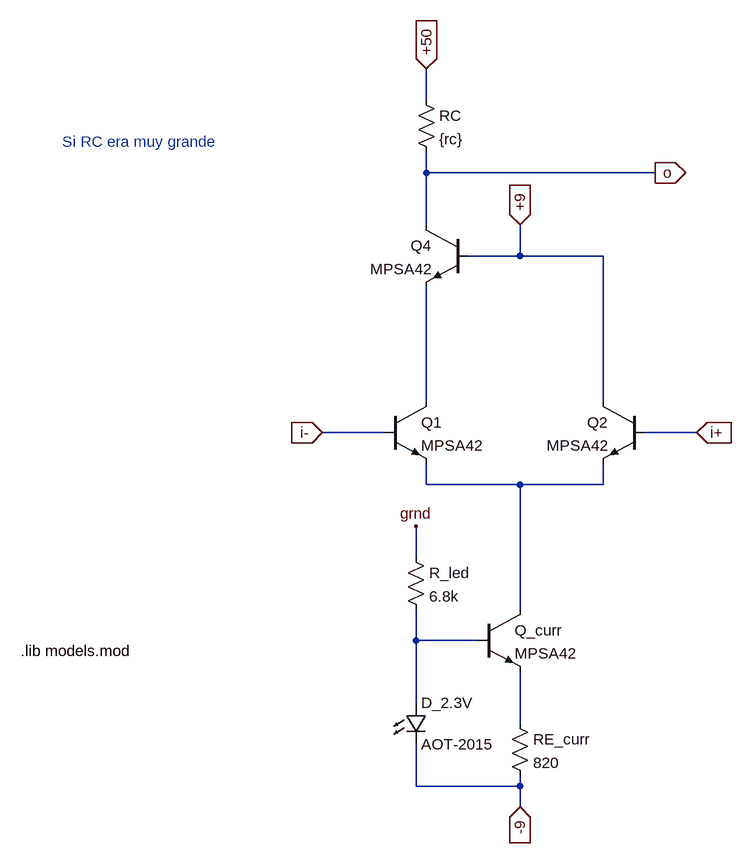
[diagram p0: schematic ss-par-npn-comp-div-ten.asc]
ss-par-npn-comp-div-ten.asc, the LTspice schematic file:
Version 4
SHEET 1 1328 980
WIRE -448 -304 -448 -352
WIRE -448 -192 -448 -224
WIRE -96 -192 -448 -192
WIRE -448 -112 -448 -192
WIRE -304 -64 -304 -112
WIRE -304 -64 -384 -64
WIRE -176 -64 -304 -64
WIRE -448 160 -448 -16
WIRE -176 160 -176 -64
WIRE -512 208 -608 208
WIRE -32 208 -112 208
WIRE -448 288 -448 256
WIRE -304 288 -448 288
WIRE -176 288 -176 256
WIRE -176 288 -304 288
WIRE -464 400 -464 352
WIRE -304 480 -304 288
WIRE -464 528 -464 480
WIRE -368 528 -464 528
WIRE -464 624 -464 528
WIRE -304 624 -304 576
WIRE -304 656 -304 624
WIRE -464 752 -464 688
WIRE -304 752 -304 736
WIRE -304 752 -464 752
WIRE -304 784 -304 752
FLAG -304 -112 +9
IOPIN -304 -112 In
FLAG -96 -192 o
IOPIN -96 -192 Out
FLAG -32 208 i+
IOPIN -32 208 In
FLAG -608 208 i-
IOPIN -608 208 In
FLAG -304 784 -9
IOPIN -304 784 In
FLAG -448 -352 +50
IOPIN -448 -352 In
FLAG -464 352 grnd
DATAFLAG -448 -192 "round($*10)/10"
DATAFLAG -304 288 "round($*1k)/1k"
DATAFLAG -464 528 "round($*100)/100"
DATAFLAG -304 624 "round($*100)/100"
SYMBOL npn -368 480 R0
SYMATTR InstName Q_curr
SYMATTR Value MPSA42
SYMBOL npn -512 160 R0
SYMATTR InstName Q1
SYMATTR Value MPSA42
SYMBOL npn -112 160 M0
SYMATTR InstName Q2
SYMATTR Value MPSA42
SYMBOL res -480 384 R0
SYMATTR InstName R_led
SYMATTR Value 6.8k
SYMBOL res -320 640 R0
SYMATTR InstName RE_curr
SYMATTR Value 820
SYMBOL LED -480 624 R0
SYMATTR InstName D_2.3V
SYMATTR Value AOT-2015
SYMBOL res -464 -320 R0
SYMATTR InstName RC
SYMATTR Value {rc}
SYMBOL npn -384 -112 M0
SYMATTR InstName Q4
SYMATTR Value MPSA42
TEXT -1072 544 Left 2 !.lib models.mod
TEXT -1008 -240 Left 2 ;Si RC era muy grande

The netlist it stands for:
* ss-par-npn-comp-div-ten.asc
Q_curr N002 N003 N004 0 MPSA42
Q1 N001 i- N002 0 MPSA42
Q2 +9 i+ N002 0 MPSA42
R_led grnd N003 6.8k
RE_curr N004 -9 820
D_2.3V N003 -9 AOT-2015
RC +50 o {rc}
Q4 o +9 N001 0 MPSA42
.model D D
.lib standard.dio
.model NPN NPN
.model PNP PNP
.lib standard.bjt
.lib models.mod
* Si RC era muy grande
.backanno
.end